# Altium project Dual_H-Bridge.PrjPcb
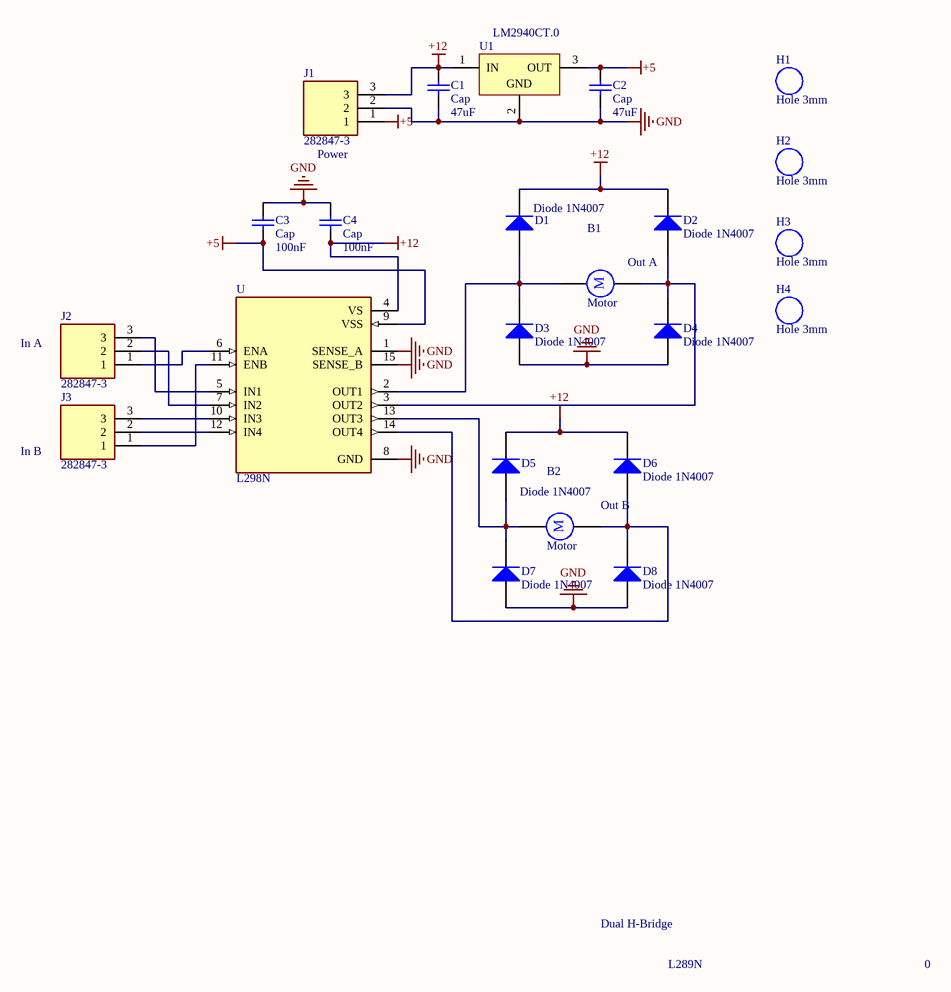
[diagram p0: Dual_H-Bridge.SchDoc]
1 sheet, 23 parts. Net scope: global (net labels, ports and power ports of the same name join across sheets).
Board file: Dual H.PcbDoc

## Sheet Dual_H-Bridge.SchDoc
size Letter

### Parts
B1  Motor  [RB5-10.5]
B2  Motor  [RB5-10.5]
C1  Cap  value 47uF  [RAD-0.3]
C2  Cap  value 47uF  [RAD-0.3]
C3  Cap  value 100nF  [RAD-0.3]
C4  Cap  value 100nF  [RAD-0.3]
D1  Diode 1N4007  [DO-41]
D2  Diode 1N4007  [DO-41]
D3  Diode 1N4007  [DO-41]
D4  Diode 1N4007  [DO-41]
D5  Diode 1N4007  [DO-41]
D6  Diode 1N4007  [DO-41]
D7  Diode 1N4007  [DO-41]
D8  Diode 1N4007  [DO-41]
H1  Hole 3mm  [Hole 3mm]
H2  Hole 3mm  [Hole 3mm]
H3  Hole 3mm  [Hole 3mm]
H4  Hole 3mm  [Hole 3mm]
J1  282847-3  [TE_282847-3]
J2  282847-3  [TE_282847-3]
J3  282847-3  [TE_282847-3]
U  L298N  [TO127P2020X500X2100-15]
U1  LM2940CT.0  [T03B]

### Nets
+5: C2.2 C3.1 J1.1 U.9(VSS) U1.3(OUT)
+12: C1.1 C4.2 D1.2(K) D2.2(K) D5.2(K) D6.2(K) J1.3 U.4(VS) U1.1(IN)
GND: C1.2 C2.1 C3.2 C4.1 D3.1(A) D4.1(A) D7.1(A) D8.1(A) J1.2 U.1(SENSE_A) U.8(GND) U.15(SENSE_B) U1.2(GND)
NetB1_1: B1.1 D1.1(A) D3.2(K) U.2(OUT1)
NetB1_2: B1.2 D2.1(A) D4.2(K) U.3(OUT2)
NetB2_1: B2.1 D5.1(A) D7.2(K) U.13(OUT3)
NetB2_2: B2.2 D6.1(A) D8.2(K) U.14(OUT4)
NetJ2_1: J2.1 U.6(ENA)
NetJ2_2: J2.2 U.7(IN2)
NetJ2_3: J2.3 U.5(IN1)
NetJ3_1: J3.1 U.11(ENB)
NetJ3_2: J3.2 U.12(IN4)
NetJ3_3: J3.3 U.10(IN3)

### Notes on the sheet
- (near J1) Power
- Out A
- In A
- In B
- Out B
- Dual H-Bridge
- L289N
- 0
- (in symbol Motor) M

### Library data of the parts
B1 B2 = Motor: Motor, General Kind; Published: 24-Mar-1999; LatestRevisionDate: 17-Jul-2002; LatestRevisionNote: Re-released for DXP Platform.; PackageReference: RB5-10.5; Publisher: Altium Limited; PackageDescription: Capacitor (Radial); 2 Leads
C1-C4 = Cap: Capacitor; Published: 8-Jun-2000; LatestRevisionDate: 17-Jul-2002; LatestRevisionNote: Re-released for DXP Platform.; PackageReference: RAD-0.3; Publisher: Altium Limited; PackageDescription: Radial Cap, Thru-Hole; 2 Leads; 0.3 in Pin Spacing
D1-D8 = Diode 1N4007: 1 Amp General Purpose Rectifier; Published: 8-Jun-2000; LatestRevisionDate: 17-Jul-2002; LatestRevisionNote: Re-released for DXP Platform.; DatasheetVersion: 1998; PackageVersion: Aug-1999; PackageReference: DO-41; Publisher: Altium Limited; PackageDescription: Diode, Axial; Body 5.2 x 2.7 mm (LxDia. max), Lead Dia. 0.86 mm (max); Code_JEDEC: DO-204-AL; ComponentLink1Description: Manufacturer Link; ComponentLink1URL: http://www.fairchildsemi.com/; ComponentLink2Description: Datasheet; ComponentLink2URL: http://www.fairchildsemi.com/ds/1N%2F1N4001.pdf
J1-J3 = 282847-3: Conn Eurostyle Block 3 POS 5.08mm Solder Thru-Hole 17.5A/Contact Automotive Carton; Number_of_Positions: 3; MF: TE Connectivity; Centerline_Pitch: 5.08 mm[.2 in]; SnapEDA_Link: https://www.snapeda.com/parts/282847-3/TE%20Connectivity%20AMP%20Connectors/view-part/558977/?ref=snap; Arrow_Electronics-Purchase-URL: https://snapeda.com/shop?store=Arrow+Electronics&id=558977; EU_RoHS_Compliance: Compliant with Exemptions; Mouser-Purchase-URL: https://snapeda.com/shop?store=Mouser&id=558977; Availability: Good; Value: *; Package: None; DigiKey-Purchase-URL: https://snapeda.com/shop?store=DigiKey&id=558977; MP: 282847-3; Price: None
U = L298N: Half Bridge _4_ Driver DC Motors, Relays, Solenoids, Stepper Motors Bipolar 15-Multiwatt; MF: STMicroelectronics; MP: L298N; Package: Multiwatt-15 STMicroelectronics; Price: None; Availability: Unavailable; Value: *; SnapEDA_Link: https://www.snapeda.com/parts/L298N/STMicroelectronics/view-part/294022/?ref=snap
U1 = LM2940CT-5.0_1: 1A Low Dropout Regulator, 3-pin TO-220; Manufacturer: National Semiconductor; PackageTopMarking: NSUZXYTTE#*LM2940CT*-5.0 P+; PowerWise: N; CompType: LDO IC; High-Reliability: Y; DatasheetVersion: Jan-2007; PackageVersion: revL, Jan-1992; PackageReference: T03B; PackageDescription: TO-220, Molded, 3 Lead, Straight; PartNumber: LM2940CT-5.0; RoHS: N; PinCount: 3; ComponentLink1Description: Manufacturer URL; ComponentLink1URL: http://www.national.com/; ComponentLink2Description: LM2940C Datasheet; ComponentLink2URL: http://www.national.com/ds/LM/LM2940C.pdf; ComponentLink3Description: LM2940C Web Page; ComponentLink3URL: http://www.national.com/pf/LM/LM2940C.html; ComponentLink4Description: T03B Package Page; ComponentLink4URL: http://www.national.com/packaging/folders/t03b.html